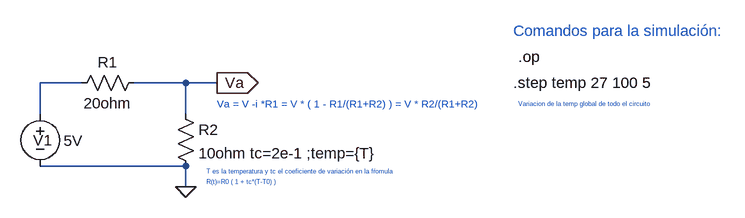
[diagram p0: schematic Resistor_Ohmico_Barrido_En_Temperatura.asc]
Resistor_Ohmico_Barrido_En_Temperatura.asc, the LTspice schematic file:
Version 4
SHEET 1 1464 680
WIRE 48 64 -16 64
WIRE 208 64 128 64
WIRE 256 64 208 64
WIRE -16 112 -16 64
WIRE 208 112 208 64
WIRE 208 192 -16 192
WIRE 208 224 208 192
FLAG 208 224 0
FLAG 256 64 Va
IOPIN 256 64 Out
SYMBOL voltage -16 96 R0
WINDOW 0 -11 56 Left 2
WINDOW 3 36 57 Left 2
WINDOW 123 0 0 Left 0
WINDOW 39 0 0 Left 0
SYMATTR InstName V1
SYMATTR Value 5V
SYMBOL res 32 80 R270
WINDOW 0 32 56 VTop 2
WINDOW 3 0 56 VBottom 2
SYMATTR InstName R1
SYMATTR Value 20ohm
SYMBOL res 192 96 R0
SYMATTR InstName R2
SYMATTR Value 10ohm tc=2e-1 ;temp={T}
TEXT 720 24 Left 2 !.op
TEXT 256 96 Left 1 ;Va = V -i *R1 = V * ( 1 - R1/(R1+R2) ) = V * R2/(R1+R2)
TEXT 712 64 Left 2 !.step temp 27 100 5
TEXT 720 96 Left 0 ;Variacion de la temp global de todo el circuito
TEXT 712 -16 Left 2 ;Comandos para la simulación:
TEXT 240 200 Left 0 ;T es la temperatura y tc el coeficiente de variación en la fŕomula
TEXT 240 216 Left 0 ;R(t)=R0 ( 1 + tc*(T-T0) )

The netlist it stands for:
* Resistor_Ohmico_Barrido_En_Temperatura.asc
V1 N001 0 5V
R1 N001 Va 20ohm
R2 Va 0 10ohm tc=2e-1 ;temp={T}
.op
* Va = V -i *R1 = V * ( 1 - R1/(R1+R2) ) = V * R2/(R1+R2)
.step temp 27 100 5
* Variacion de la temp global de todo el circuito
* Comandos para la simulación:
* T es la temperatura y tc el coeficiente de variación en la fŕomula
* R(t)=R0 ( 1 + tc*(T-T0) )
.backanno
.end